# Altium schematic sheet 12-Electrodes.SchDoc: Electrodes
size A2; DocumentNumber: 12; SheetNumber: 12; SheetTotal: 15
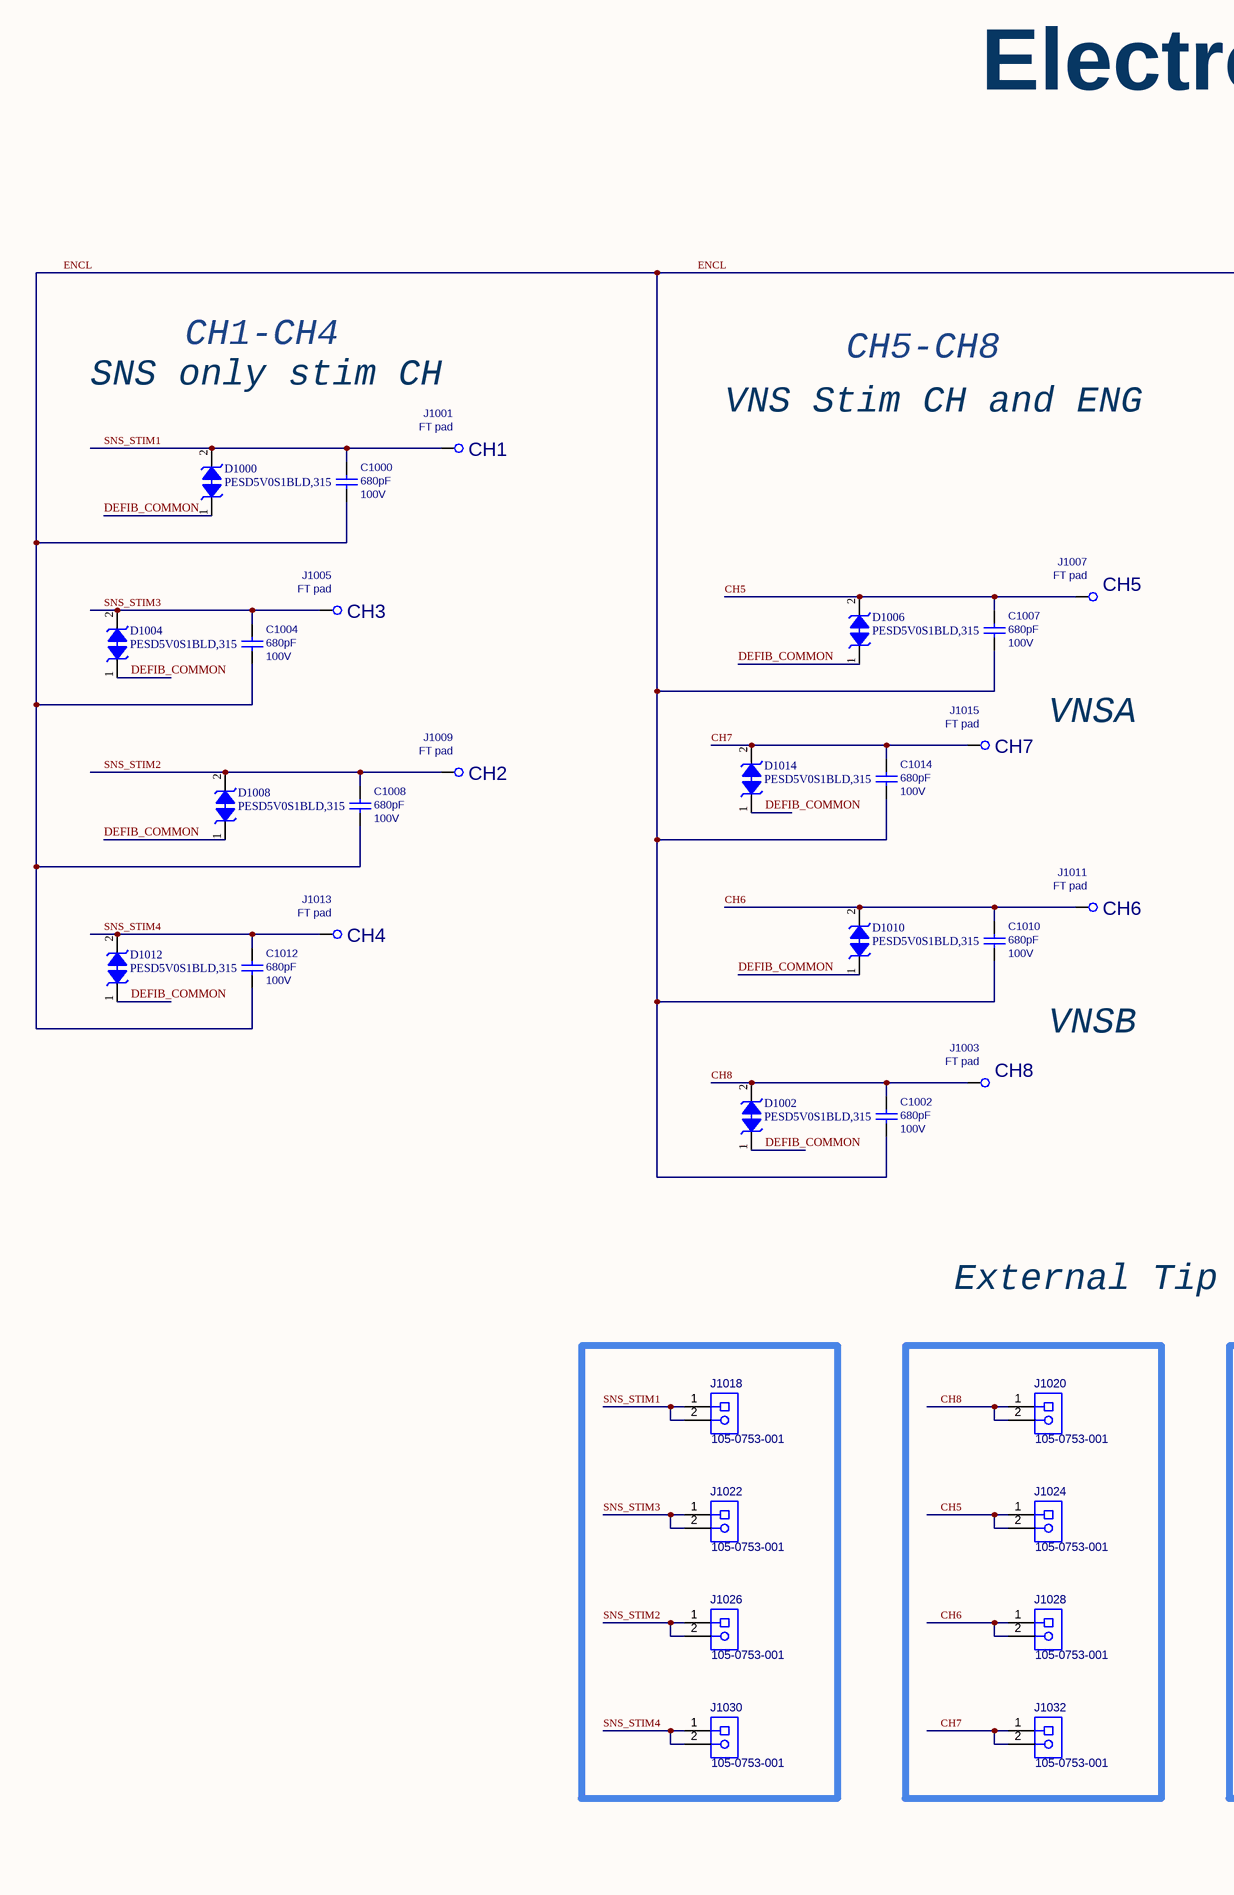
[diagram p0: 12-Electrodes.SchDoc, left]
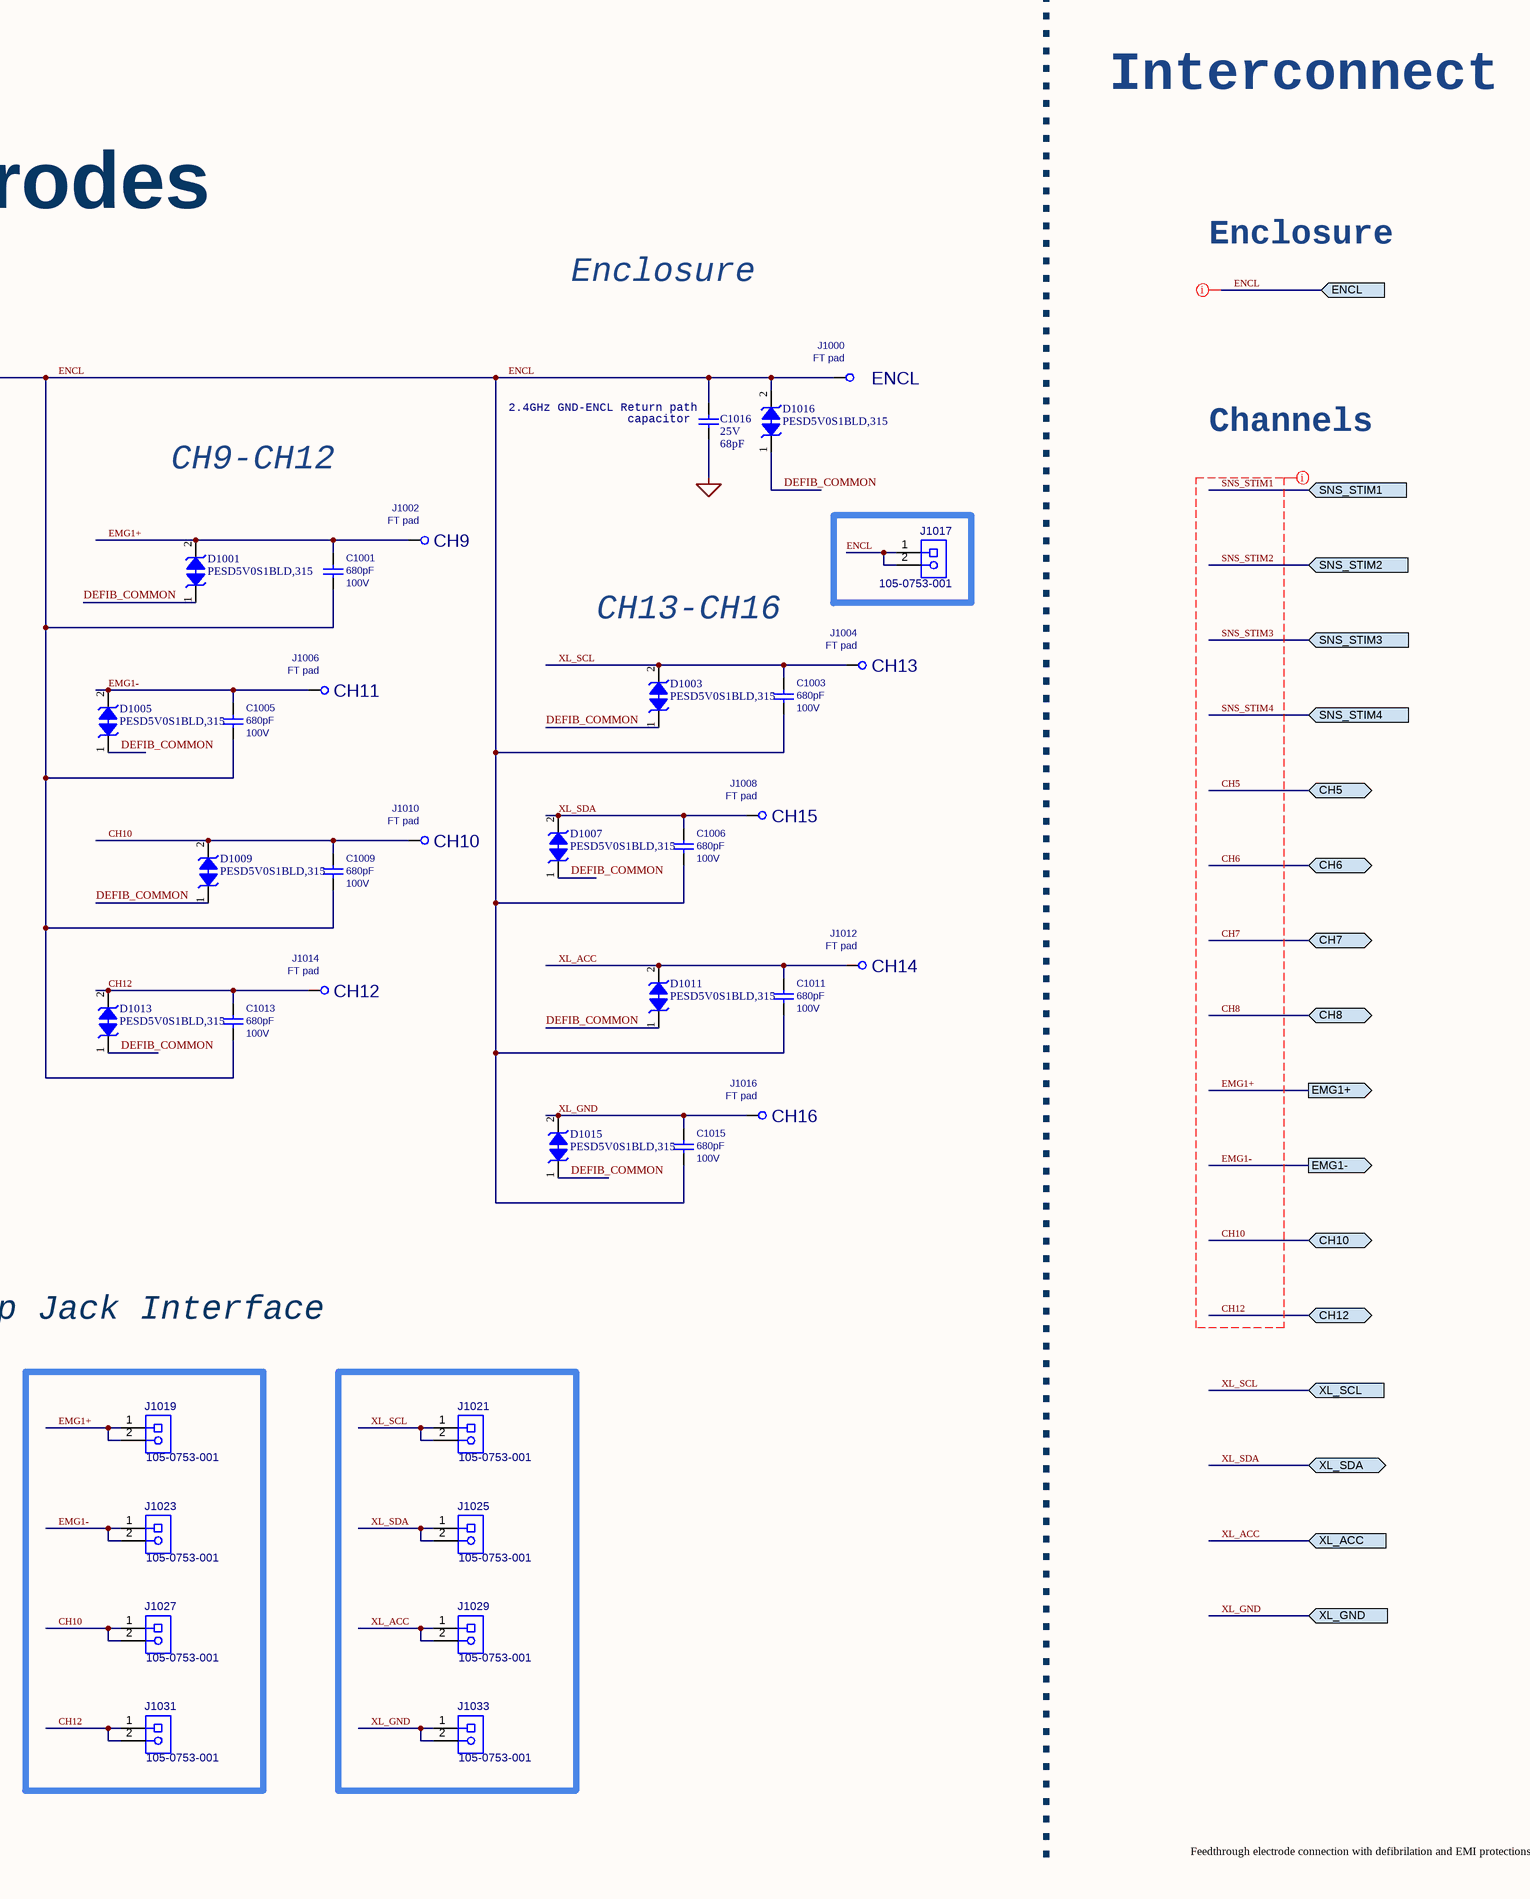
[diagram p1: 12-Electrodes.SchDoc, right]

## Parts
C1000  value 680pF  Rating: 100V  [CAP0402_REDUCED]  (hidden comment: C1005C0G2A681J050BE)
C1001  value 680pF  Rating: 100V  [CAP0402_REDUCED]  (hidden comment: C1005C0G2A681J050BE)
C1002  value 680pF  Rating: 100V  [CAP0402_REDUCED]  (hidden comment: C1005C0G2A681J050BE)
C1003  value 680pF  Rating: 100V  [CAP0402_REDUCED]  (hidden comment: C1005C0G2A681J050BE)
C1004  value 680pF  Rating: 100V  [CAP0402_REDUCED]  (hidden comment: C1005C0G2A681J050BE)
C1005  value 680pF  Rating: 100V  [CAP0402_REDUCED]  (hidden comment: C1005C0G2A681J050BE)
C1006  value 680pF  Rating: 100V  [CAP0402_REDUCED]  (hidden comment: C1005C0G2A681J050BE)
C1007  value 680pF  Rating: 100V  [CAP0402_REDUCED]  (hidden comment: C1005C0G2A681J050BE)
C1008  value 680pF  Rating: 100V  [CAP0402_REDUCED]  (hidden comment: C1005C0G2A681J050BE)
C1009  value 680pF  Rating: 100V  [CAP0402_REDUCED]  (hidden comment: C1005C0G2A681J050BE)
C1010  value 680pF  Rating: 100V  [CAP0402_REDUCED]  (hidden comment: C1005C0G2A681J050BE)
C1011  value 680pF  Rating: 100V  [CAP0402_REDUCED]  (hidden comment: C1005C0G2A681J050BE)
C1012  value 680pF  Rating: 100V  [CAP0402_REDUCED]  (hidden comment: C1005C0G2A681J050BE)
C1013  value 680pF  Rating: 100V  [CAP0402_REDUCED]  (hidden comment: C1005C0G2A681J050BE)
C1014  value 680pF  Rating: 100V  [CAP0402_REDUCED]  (hidden comment: C1005C0G2A681J050BE)
C1015  value 680pF  Rating: 100V  [CAP0402_REDUCED]  (hidden comment: C1005C0G2A681J050BE)
C1016  value 68pF  Voltage Rating: 25V  [C0201_C]  (hidden comment: GRT0335C1E680JA02D)
D1000  PESD5V0S1BLD,315  [PESD5V0S1BLD315]
D1001  PESD5V0S1BLD,315  [PESD5V0S1BLD315]
D1002  PESD5V0S1BLD,315  [PESD5V0S1BLD315]
D1003  PESD5V0S1BLD,315  [PESD5V0S1BLD315]
D1004  PESD5V0S1BLD,315  [PESD5V0S1BLD315]
D1005  PESD5V0S1BLD,315  [PESD5V0S1BLD315]
D1006  PESD5V0S1BLD,315  [PESD5V0S1BLD315]
D1007  PESD5V0S1BLD,315  [PESD5V0S1BLD315]
D1008  PESD5V0S1BLD,315  [PESD5V0S1BLD315]
D1009  PESD5V0S1BLD,315  [PESD5V0S1BLD315]
D1010  PESD5V0S1BLD,315  [PESD5V0S1BLD315]
D1011  PESD5V0S1BLD,315  [PESD5V0S1BLD315]
D1012  PESD5V0S1BLD,315  [PESD5V0S1BLD315]
D1013  PESD5V0S1BLD,315  [PESD5V0S1BLD315]
D1014  PESD5V0S1BLD,315  [PESD5V0S1BLD315]
D1015  PESD5V0S1BLD,315  [PESD5V0S1BLD315]
D1016  PESD5V0S1BLD,315  [PESD5V0S1BLD315]
J1000  value FT pad  [FEEDHOLE_20mil]  (hidden comment: THPAD_20m)  (no BOM)
J1001  value FT pad  [FEEDHOLE_20mil]  (hidden comment: THPAD_20m)  (no BOM)
J1002  value FT pad  [FEEDHOLE_20mil]  (hidden comment: THPAD_20m)  (no BOM)
J1003  value FT pad  [FEEDHOLE_20mil]  (hidden comment: THPAD_20m)  (no BOM)
J1004  value FT pad  [FEEDHOLE_20mil]  (hidden comment: THPAD_20m)  (no BOM)
J1005  value FT pad  [FEEDHOLE_20mil]  (hidden comment: THPAD_20m)  (no BOM)
J1006  value FT pad  [FEEDHOLE_20mil]  (hidden comment: THPAD_20m)  (no BOM)
J1007  value FT pad  [FEEDHOLE_20mil]  (hidden comment: THPAD_20m)  (no BOM)
J1008  value FT pad  [FEEDHOLE_20mil]  (hidden comment: THPAD_20m)  (no BOM)
J1009  value FT pad  [FEEDHOLE_20mil]  (hidden comment: THPAD_20m)  (no BOM)
J1010  value FT pad  [FEEDHOLE_20mil]  (hidden comment: THPAD_20m)  (no BOM)
J1011  value FT pad  [FEEDHOLE_20mil]  (hidden comment: THPAD_20m)  (no BOM)
J1012  value FT pad  [FEEDHOLE_20mil]  (hidden comment: THPAD_20m)  (no BOM)
J1013  value FT pad  [FEEDHOLE_20mil]  (hidden comment: THPAD_20m)  (no BOM)
J1014  value FT pad  [FEEDHOLE_20mil]  (hidden comment: THPAD_20m)  (no BOM)
J1015  value FT pad  [FEEDHOLE_20mil]  (hidden comment: THPAD_20m)  (no BOM)
J1016  value FT pad  [FEEDHOLE_20mil]  (hidden comment: THPAD_20m)  (no BOM)
J1017  value 105-0753-001  [105-07XX-001]  (hidden comment: 105-07XX-001)
J1018  value 105-0753-001  [105-07XX-001]  (hidden comment: 105-07XX-001)
J1019  value 105-0753-001  [105-07XX-001]  (hidden comment: 105-07XX-001)
J1020  value 105-0753-001  [105-07XX-001]  (hidden comment: 105-07XX-001)
J1021  value 105-0753-001  [105-07XX-001]  (hidden comment: 105-07XX-001)
J1022  value 105-0753-001  [105-07XX-001]  (hidden comment: 105-07XX-001)
J1023  value 105-0753-001  [105-07XX-001]  (hidden comment: 105-07XX-001)
J1024  value 105-0753-001  [105-07XX-001]  (hidden comment: 105-07XX-001)
J1025  value 105-0753-001  [105-07XX-001]  (hidden comment: 105-07XX-001)
J1026  value 105-0753-001  [105-07XX-001]  (hidden comment: 105-07XX-001)
J1027  value 105-0753-001  [105-07XX-001]  (hidden comment: 105-07XX-001)
J1028  value 105-0753-001  [105-07XX-001]  (hidden comment: 105-07XX-001)
J1029  value 105-0753-001  [105-07XX-001]  (hidden comment: 105-07XX-001)
J1030  value 105-0753-001  [105-07XX-001]  (hidden comment: 105-07XX-001)
J1031  value 105-0753-001  [105-07XX-001]  (hidden comment: 105-07XX-001)
J1032  value 105-0753-001  [105-07XX-001]  (hidden comment: 105-07XX-001)
J1033  value 105-0753-001  [105-07XX-001]  (hidden comment: 105-07XX-001)

## Ports
CH5 (bidir), CH6 (bidir), CH7 (bidir), CH8 (bidir), CH10 (bidir), CH12 (bidir), EMG1+ (out), EMG1- (out), ENCL (in), SNS_STIM1 (in), SNS_STIM2 (in), SNS_STIM3 (in), SNS_STIM4 (in), XL_ACC (in), XL_GND (in), XL_SCL (in), XL_SDA (bidir)

## Nets
GND: C1016.1
CH5: C1007.2 D1006.2(K2) J1007.1 J1024.1 J1024.2 ; port CH5
CH6: C1010.2 D1010.2(K2) J1011.1 J1028.1 J1028.2 ; port CH6
CH7: C1014.2 D1014.2(K2) J1015.1 J1032.1 J1032.2 ; port CH7
CH8: C1002.2 D1002.2(K2) J1003.1 J1020.1 J1020.2 ; port CH8
CH10: C1009.2 D1009.2(K2) J1010.1 J1027.1 J1027.2 ; port CH10
CH12: C1013.2 D1013.2(K2) J1014.1 J1031.1 J1031.2 ; port CH12
DEFIB_COMMON: D1000.1(K1) D1001.1(K1) D1002.1(K1) D1003.1(K1) D1004.1(K1) D1005.1(K1) D1006.1(K1) D1007.1(K1) D1008.1(K1) D1009.1(K1) D1010.1(K1) D1011.1(K1) D1012.1(K1) D1013.1(K1) D1014.1(K1) D1015.1(K1) D1016.1(K1)
EMG1+: C1001.2 D1001.2(K2) J1002.1 J1019.1 J1019.2 ; port EMG1+
EMG1-: C1005.2 D1005.2(K2) J1006.1 J1023.1 J1023.2 ; port EMG1-
ENCL: C1000.1 C1001.1 C1002.1 C1003.1 C1004.1 C1005.1 C1006.1 C1007.1 C1008.1 C1009.1 C1010.1 C1011.1 C1012.1 C1013.1 C1014.1 C1015.1 C1016.2 D1016.2(K2) J1000.1 J1017.1 J1017.2 ; port ENCL
SNS_STIM1: C1000.2 D1000.2(K2) J1001.1 J1018.1 J1018.2 ; port SNS_STIM1
SNS_STIM2: C1008.2 D1008.2(K2) J1009.1 J1026.1 J1026.2 ; port SNS_STIM2
SNS_STIM3: C1004.2 D1004.2(K2) J1005.1 J1022.1 J1022.2 ; port SNS_STIM3
SNS_STIM4: C1012.2 D1012.2(K2) J1013.1 J1030.1 J1030.2 ; port SNS_STIM4
XL_ACC: C1011.2 D1011.2(K2) J1012.1 J1029.1 J1029.2 ; port XL_ACC
XL_GND: C1015.2 D1015.2(K2) J1016.1 J1033.1 J1033.2 ; port XL_GND
XL_SCL: C1003.2 D1003.2(K2) J1004.1 J1021.1 J1021.2 ; port XL_SCL
XL_SDA: C1006.2 D1007.2(K2) J1008.1 J1025.1 J1025.2 ; port XL_SDA

## Layout directives
net class ANALOG: CH5, CH6, CH7, CH8, CH10, CH12, EMG1+, EMG1-, ENCL, SNS_STIM1, SNS_STIM2, SNS_STIM3, SNS_STIM4

## Notes on the sheet
- Interconnect
- Electrodes
- Enclosure
- (near C1016) 2.4GHz GND-ENCL Return path
- (near C1016) capacitor
- (near J1000) ENCL
- SNS only stim CH
- CH1-CH4
- CH5-CH8
- CH9-CH12
- Channels
- (near J1001) CH1
- VNS Stim CH and ENG
- (near J1002) CH9
- (near J1007) CH5
- CH13-CH16
- (near J1004) CH13
- (near J1005) CH3
- (near J1006) CH11
- VNSA
- (near J1009) CH2
- (near J1015) CH7
- (near J1010) CH10
- (near J1008) CH15
- (near J1011) CH6
- (near J1012) CH14
- (near J1013) CH4
- (near J1014) CH12
- VNSB
- (near J1003) CH8
- (near J1016) CH16
- External Tip Jack Interface
- Feedthrough electrode connection with defibrilation and EMI protections.
- Project:
- Schematic:
- Design by:
- Date:
- Ver:
- .
- Comments:
- Reviewed by:

## Library data of the parts
C1000-C1015 = C1005C0G2A681J050BE: Capacitor, 680pF, C0G, 100V, 5%, 0402; Manufacturer: TDK; Medical Grade MFR: TBD; Review: 020823; Length (mm): 1.00 ±0.10; Medical Grade MFR PN: TBD; PCB Footprint: TBD; Thickness (mm): 0.50 ±0.10; Width (mm): 0.50 ±0.10; Category: Capacitor; Package Description: 0402; Supplier 1: Arrow Electronics; Supplier Part Number 1: C1005C0G2A681J050BE; Status: Approved; Manufacturer Part Number: C1005C0G2A681J050BE
C1016 = GRT0335C1E680JA02D: Capacitor, 68pF, C0G, 25V, 5%, 0201, Implant-grade; Manufacturer: Murata; Medical Grade Manufacturer: TBD; Category: Capacitor; Manufacturer Part Number: GRT0335C1E680JA02D; Medical Grade Manufacturer Part Number: TBD; Size Code: Size Code; Supplier: TBD; Supplier Part Number: TBD; Height: 0.3mm; Width: 0.3mm; Length: 0.6mm; Tolerance: 5%; Dielectric: C0G; Supplier 1: Mouser; Supplier Part Number 1: 81-GRT0335C1E680JA2D; Supplier 2: Digikey; Supplier Part Number 2: 490-GRT0335C1E680JA02DTR-ND
D1000-D1016 = PESD5V0S1BLD,315: Diode ESD (Bi-directional); Manufacturer: Nexperia; Datasheet Link: https://assets.nexperia.com/documents/data-sheet/PESD5V0S1BLD.pdf; Height: 0.4mm; Mouser Part Number: 771-PESD5V0S1BLD315; Mouser Price/Stock: https://www.mouser.co.uk/ProductDetail/Nexperia/PESD5V0S1BLD315?qs=A1cBxND5mHLYeryYrbux2w%3D%3D; Arrow Part Number: PESD5V0S1BLD,315; Arrow Price/Stock: https://www.arrow.com/en/products/pesd5v0s1bld315/nexperia?region=nac; Manufacturer Part Number: PESD5V0S1BLD,315; Supplier 1: Future Electronics; Supplier Part Number 1: 8158301
J1000-J1016 = HOLE_20m: FT pad, Thru-hole, 20 mil hole; PCB Footprint: TBD; Category: FT pad; Length (mm): TBD; Manufacturer: N/A; Manufacturer PN: N/A; Medical Grade MFR: N/A; Medical Grade MFR PN: N/A; Rating: N/A; Thickness (mm): N/A; Width (mm): TBD; Package Description: FT pad; Status: *; Review: *
J1017-J1033 = 105-07XX-001: Connector, Bannana Tip, Through Hole, Rodent Study lead connector; Manufacturer: Cinch Connectivity Solutions Johnson; Supplier 1: Mouser; Supplier Part Number 1: 530-10507531; Manufacturer Part Number: 105-0753-001